# Altium schematic sheet PowerSupply12v30A.SchDoc
size A4
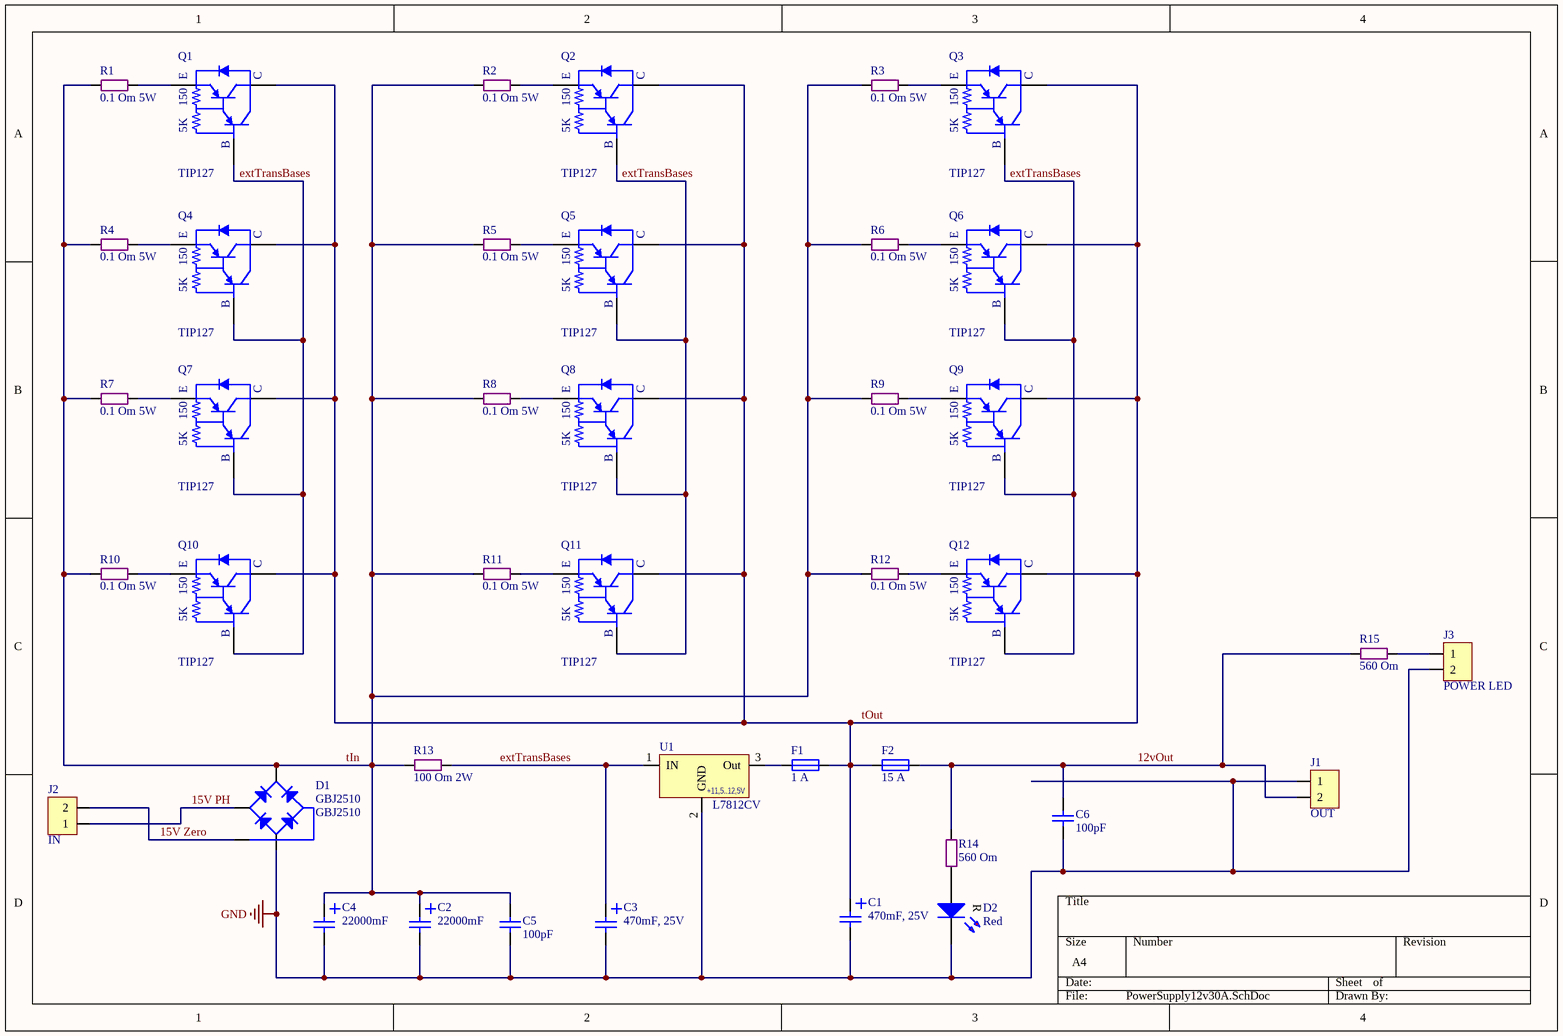
[diagram p0: PowerSupply12v30A.SchDoc]

## Parts
C1  470mF, 25V  [Cap E p3.5mm D8xH12]
C2  22000mF  [Cap E p10mm D30mm (4p)]
C3  470mF, 25V  [Cap E p3.5mm D8xH12]
C4  22000mF  [Cap E p10mm D30mm (4p)]
C5  100pF  [SMD 1206 (3216)]
C6  100pF  [SMD 0805 (2012)]
D1  GBJ2510  [GBJ]
D2  Red  [LED Round 5mm red]
F1  1 A  [Fuse 9p]
F2  15 A  [Fuse 9p]
J1  OUT  [DG301 5mm 2p]
J2  IN  [DG301 5mm 2p]
J3  POWER LED  [CWF-2 R]
Q1  TIP127  [TO220-2]
Q2  TIP127  [TO220-2]
Q3  TIP127  [TO220-2]
Q4  TIP127  [TO220-2]
Q5  TIP127  [TO220-2]
Q6  TIP127  [TO220-2]
Q7  TIP127  [TO220-2]
Q8  TIP127  [TO220-2]
Q9  TIP127  [TO220-2]
Q10  TIP127  [TO220-2]
Q11  TIP127  [TO220-2]
Q12  TIP127  [TO220-2]
R1  0.1 Om 5W  [Res 5W L22mm, p30mm]
R2  0.1 Om 5W  [Res 5W L22mm, p30mm]
R3  0.1 Om 5W  [Res 5W L22mm, p30mm]
R4  0.1 Om 5W  [Res 5W L22mm, p30mm]
R5  0.1 Om 5W  [Res 5W L22mm, p30mm]
R6  0.1 Om 5W  [Res 5W L22mm, p30mm]
R7  0.1 Om 5W  [Res 5W L22mm, p30mm]
R8  0.1 Om 5W  [Res 5W L22mm, p30mm]
R9  0.1 Om 5W  [Res 5W L22mm, p30mm]
R10  0.1 Om 5W  [Res 5W L22mm, p30mm]
R11  0.1 Om 5W  [Res 5W L22mm, p30mm]
R12  0.1 Om 5W  [Res 5W L22mm, p30mm]
R13  100 Om 2W  [Res p20.32 (9p) 2w]
R14  560 Om  [Res p7.62 (4p) 0.25w]
R15  560 Om  [Res p7.62 (4p) 0.25w]
U1  L7812CV  V Out: +11,5..12,5V  [TO220-2]

## Nets
GND: C1.2 C2.2 C3.2 C4.2 C5.2 C6.2 D1.G D2.K J1.1 J3.2 U1.2(GND)
12vOut: C6.1 F2.2 J1.2 R14.2 R15.2
15V PH: D1.P(Ph) J2.1
15V Zero: D1.Z J2.2
extTransBases: C3.1 Q1.1(B) Q2.1(B) Q3.1(B) Q4.1(B) Q5.1(B) Q6.1(B) Q7.1(B) Q8.1(B) Q9.1(B) Q10.1(B) Q11.1(B) Q12.1(B) R13.2 U1.1(IN)
tIn: C2.1 C4.1 C5.1 D1.V R1.1 R2.1 R3.1 R4.1 R5.1 R6.1 R7.1 R8.1 R9.1 R10.1 R11.1 R12.1 R13.1
tOut: C1.1 F1.2 F2.1 Q1.2(C) Q2.2(C) Q3.2(C) Q4.2(C) Q5.2(C) Q6.2(C) Q7.2(C) Q8.2(C) Q9.2(C) Q10.2(C) Q11.2(C) Q12.2(C)
NetD2_A: D2.A R14.1
NetF1_1: F1.1 U1.3(Out)
NetJ3_1: J3.1 R15.1
NetQ1_3: Q1.3(E) R1.2
NetQ2_3: Q2.3(E) R2.2
NetQ3_3: Q3.3(E) R3.2
NetQ4_3: Q4.3(E) R4.2
NetQ5_3: Q5.3(E) R5.2
NetQ6_3: Q6.3(E) R6.2
NetQ7_3: Q7.3(E) R7.2
NetQ8_3: Q8.3(E) R8.2
NetQ9_3: Q9.3(E) R9.2
NetQ10_3: Q10.3(E) R10.2
NetQ11_3: Q11.3(E) R11.2
NetQ12_3: Q12.3(E) R12.2

## Notes on the sheet
- (in symbol Led Round 5mm Red) R
- (in symbol TIP127) 150; 5K

## Library data of the parts
C1 C3 = Cap E 470mF x 25V: Capacitor; Capacity (mF): 470; Voltage (V): 25; Value: 470mF, 25V
C2 C4 = Cap E 22000mF x 25V: Capacitor
C5 C6 = Cap SMD 0402-1812: Capacitor
D1 = Bridge GBJ2510: 25 A Diode Bridge; Voltage: 1000V; I: 25A; Voltage Reverse: 700V; PackageReference: GBJ; ComponentLink2Description: Datasheet; ComponentLink2URL: http://lib.chipdip.ru/921/DOC000921742.pdf; VALUE: GBJ2510
D2 = Led Round 5mm Red: 1.8-2v 20mA, 4-5cd; Forward Voltage Min: 1.8; Forward Voltage TYP: 2; Wave len min/typ: 615/625; Liminous Min (mcd): 4000; Liminous Typ (mcd): 5000; Forward Amp (mA): 20; Color: Red
F1 F2 = Fuse: Round fuse
J1 J2 = DG301-5.0-2P12: DG301 series
J3 = CWF-2 (R): CWF series
Q1-Q12 = TIP127: PNP Darlington Bipolar Transistor; U max: 100V; I max: 5A; I imp: 8A; h21e: >1000; P max: 65W; Code_JEDEC: TO-220; Channnel: PNP
R1-R12 = Res 5W: 5W Cement
R13 = Res 2W: 5W Cement
R14 R15 = Res Carbon
U1 = L7812CV: Voltage Regulator; Manufacturer: ST; I output (A): 1.5; Max Voltage In (V): 35; t: 0...+150°C; Dropuot: 2V; Case: TO220; Name: L7812CV; Dtatsheet: http://tec.org.ru/board/0-0-0-1633-20